# Altium project QDrive.PrjPcb
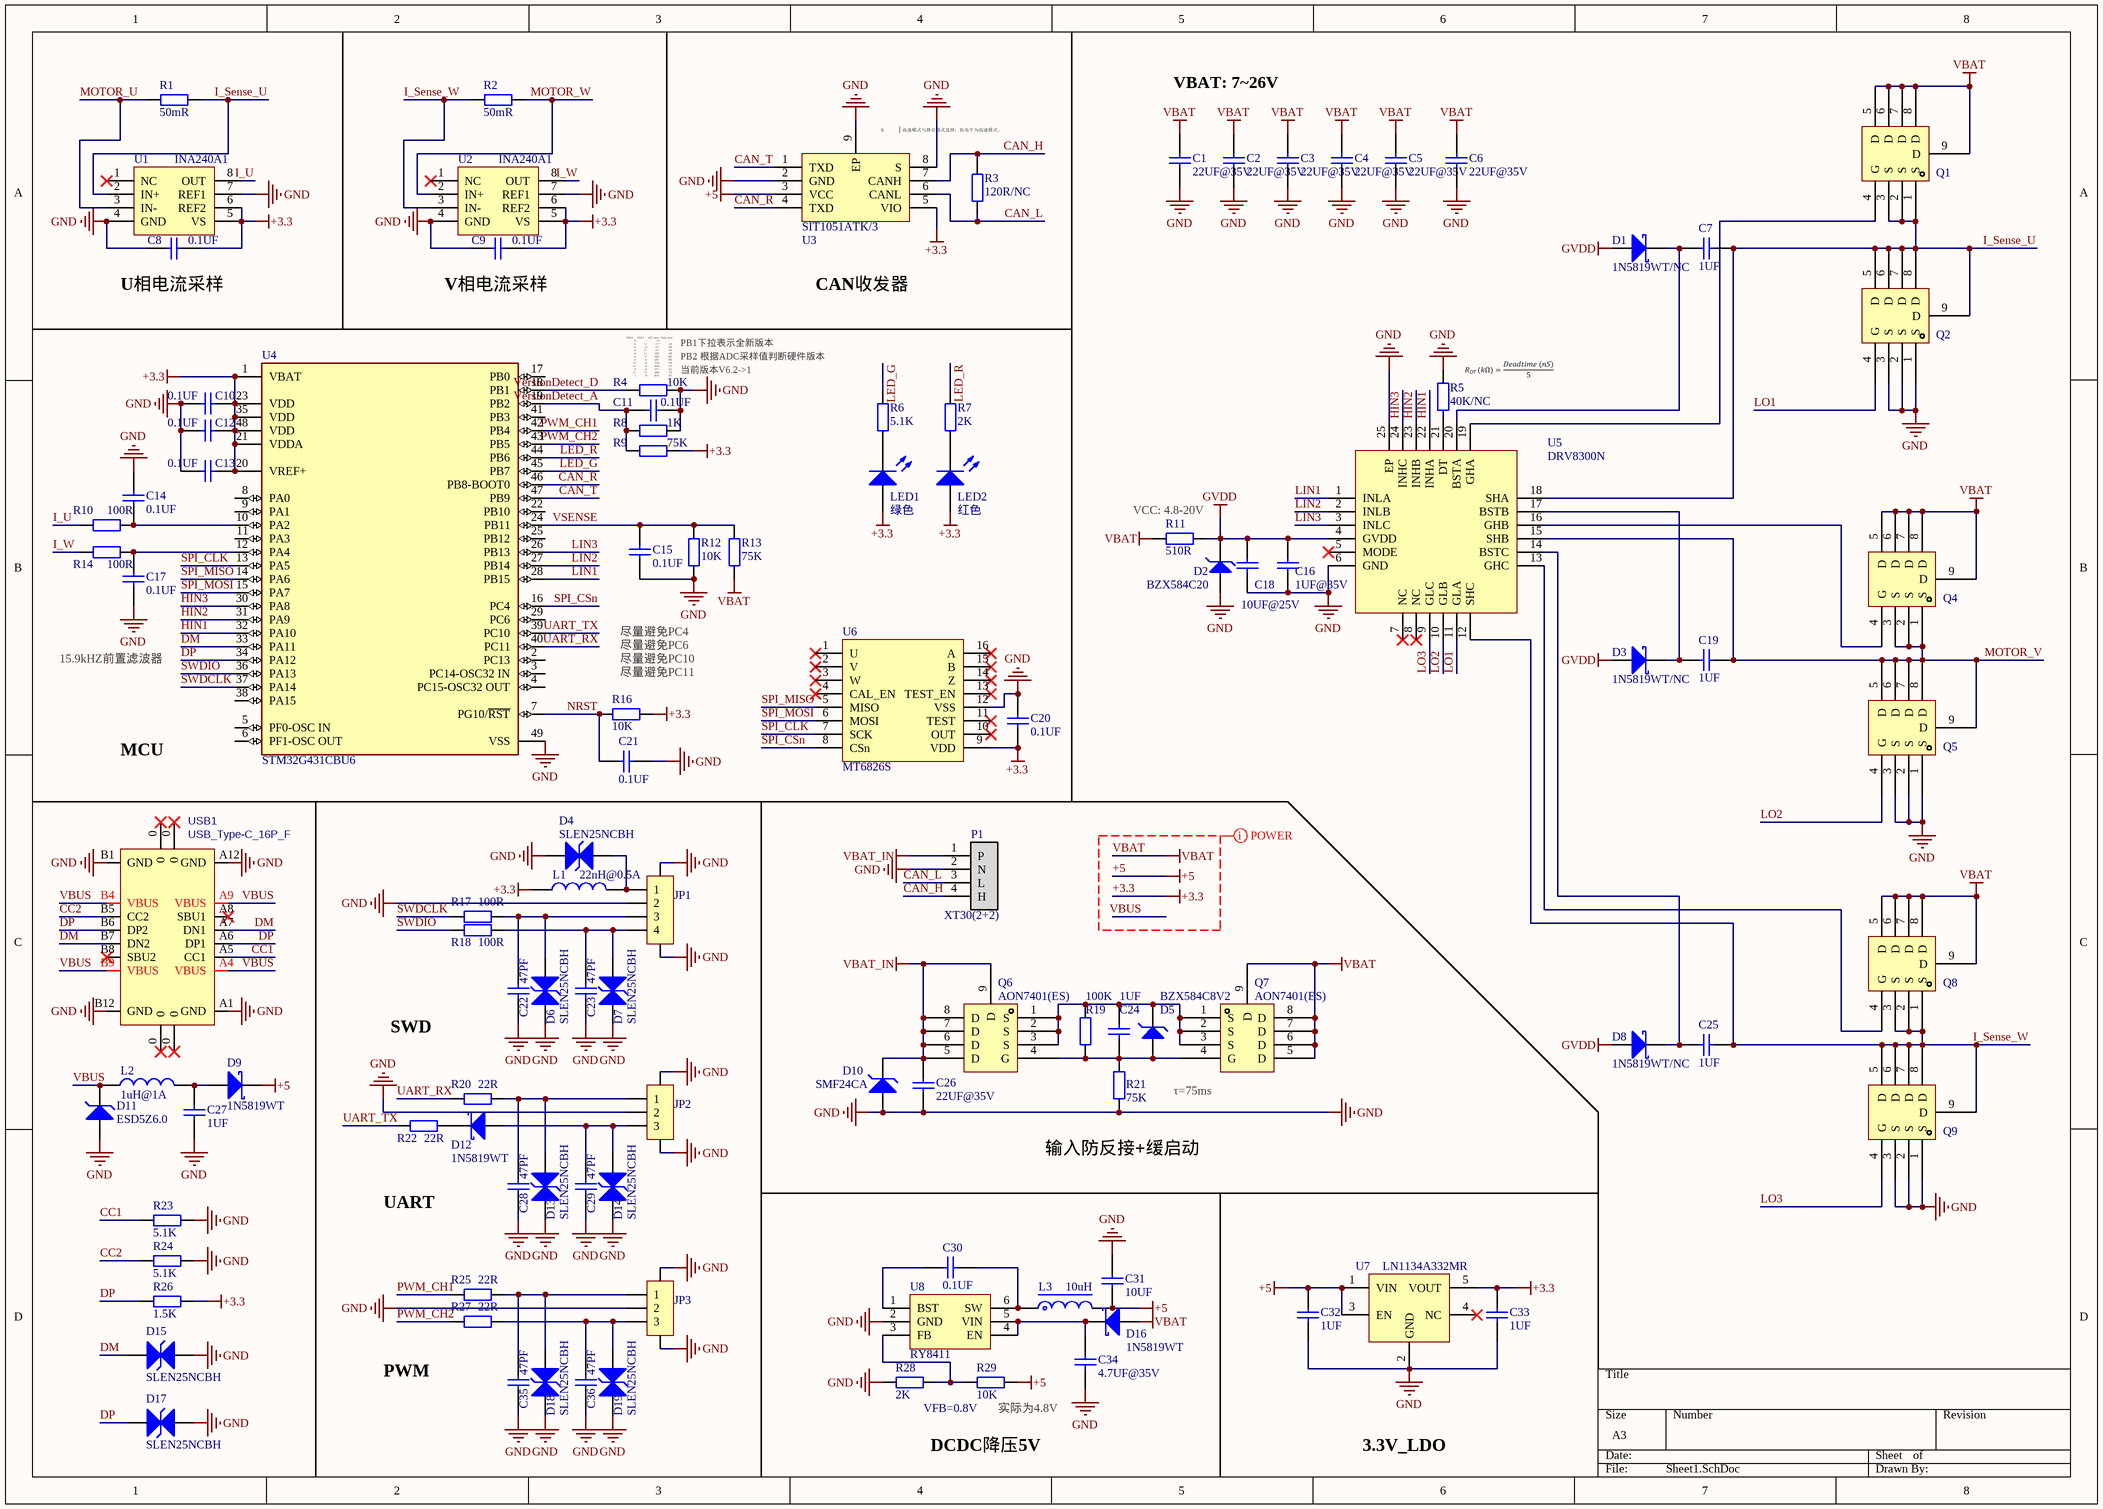
[diagram p0: Sheet1.SchDoc]
1 sheet, 109 parts. Net scope: global (net labels, ports and power ports of the same name join across sheets).
Board file: PCB1.PcbDoc

## Sheet Sheet1.SchDoc
size A3; SheetNumber: 1; SheetTotal: 1

### Parts
C1  22UF@35V  [C1206_NS]
C2  22UF@35V  [C1206_NS]
C3  22UF@35V  [C1206_NS]
C4  22UF@35V  [C1206_NS]
C5  22UF@35V  [C1206_NS]
C6  22UF@35V  [C1206_NS]
C7  1UF  [C0603_NS]
C8  0.1UF  [C0402_NS]
C9  0.1UF  [C0402_NS]
C10  0.1UF  [C0402_NS]
C11  0.1UF  [C0402_NS]
C12  0.1UF  [C0402_NS]
C13  0.1UF  [C0402_NS]
C14  0.1UF  [C0402_NS]
C15  0.1UF  [C0402_NS]
C16  1UF@35V  [C0603_NS]
C17  0.1UF  [C0402_NS]
C18  10UF@25V  [C0603_NS]
C19  1UF  [C0603_NS]
C20  0.1UF  [C0402_NS]
C21  0.1UF  [C0402_NS]
C22  47PF  [C0402_NS]
C23  47PF  [C0402_NS]
C24  1UF  [C0402_NS]
C25  1UF  [C0603_NS]
C26  22UF@35V  [C1206_NS]
C27  1UF  [C0603_NS]
C28  47PF  [C0402_NS]
C29  47PF  [C0402_NS]
C30  0.1UF  [C0402_NS]
C31  10UF  [C0805_NS]
C32  1UF  [C0402_NS]
C33  1UF  [C0402_NS]
C34  4.7UF@35V  [C0805_NS]
C35  47PF  [C0402_NS]
C36  47PF  [C0402_NS]
D1  1N5819WT/NC  [SOD-523]
D2  BZX584C20  [SOD-523]
D3  1N5819WT/NC  [SOD-523]
D4  SLEN25NCBH  [DFN1006-2L_L1.0_W0.6_P0.7]
D5  BZX584C8V2  [SOD-523]
D6  SLEN25NCBH  [DFN1006-2L_L1.0_W0.6_P0.7]
D7  SLEN25NCBH  [DFN1006-2L_L1.0_W0.6_P0.7]
D8  1N5819WT/NC  [SOD-523]
D9  1N5819WT  [SOD-523]
D10  SMF24CA  [SOD-123]
D11  ESD5Z6.0  [SOD-523]
D12  1N5819WT  [SOD-523]
D13  SLEN25NCBH  [DFN1006-2L_L1.0_W0.6_P0.7]
D14  SLEN25NCBH  [DFN1006-2L_L1.0_W0.6_P0.7]
D15  SLEN25NCBH  [DFN1006-2L_L1.0_W0.6_P0.7]
D16  1N5819WT  [SOD-523]
D17  SLEN25NCBH  [DFN1006-2L_L1.0_W0.6_P0.7]
D18  SLEN25NCBH  [DFN1006-2L_L1.0_W0.6_P0.7]
D19  SLEN25NCBH  [DFN1006-2L_L1.0_W0.6_P0.7]
JP1  CON-4P  [HC0.8-WT-4P]  (value not drawn)
JP2  CON-3P  [SH1.0-WT-3P]  (value not drawn)
JP3  CON-3P  [SH1.0-WT-3P]  (value not drawn)
L1  22nH@0.5A  [L0402_NS]
L2  1uH@1A  [L1206_NS]
L3  10uH  [NR3015]
LED1  绿色  [LED0402_NS]
LED2  红色  [LED0402_NS]
P1  XT30(2+2)  [XT30(2+2)PW-M]
Q1  AON7410  [DFN8_L3.3_W3.3_P0.65]  (value not drawn)
Q2  AON7410  [DFN8_L3.3_W3.3_P0.65]  (value not drawn)
Q4  AON7410  [DFN8_L3.3_W3.3_P0.65]  (value not drawn)
Q5  AON7410  [DFN8_L3.3_W3.3_P0.65]  (value not drawn)
Q6  AON7401(ES)  [DFN8_L3.3_W3.3_P0.65]
Q7  AON7401(ES)  [DFN8_L3.3_W3.3_P0.65]
Q8  AON7410  [DFN8_L3.3_W3.3_P0.65]  (value not drawn)
Q9  AON7410  [DFN8_L3.3_W3.3_P0.65]  (value not drawn)
R1  50mR  [R1206_NS]
R2  50mR  [R1206_NS]
R3  120R/NC  [R0603_NS]
R4  10K  [R0402_NS]
R5  40K/NC  [R0402_NS]
R6  5.1K  [R0402_NS]
R7  2K  [R0402_NS]
R8  1K  [R0402_NS]
R9  75K  [R0402_NS]
R10  100R  [R0402_NS]
R11  510R  [R0603_NS]
R12  10K  [R0402_NS]
R13  75K  [R0402_NS]
R14  100R  [R0402_NS]
R16  10K  [R0402_NS]
R17  100R  [R0402_NS]
R18  100R  [R0402_NS]
R19  100K  [R0402_NS]
R20  22R  [R0402_NS]
R21  75K  [R0402_NS]
R22  22R  [R0402_NS]
R23  5.1K  [R0402_NS]
R24  5.1K  [R0402_NS]
R25  22R  [R0402_NS]
R26  1.5K  [R0402_NS]
R27  22R  [R0402_NS]
R28  2K  [R0402_NS]
R29  10K  [R0402_NS]
U1  INA240A1  [TSSOP8_L4.4_W3.0_P0.65]
U2  INA240A1  [TSSOP8_L4.4_W3.0_P0.65]
U3  SIT1051ATK/3  [DFN8_L3.0_W3.0_P0.65]
U4  STM32G431CBU6  [QFN48_L7.0_W7.0_P0.5]
U5  DRV8300N  [QFN24_L4.0_W4.0_P0.5]
U6  MT6826S  [TSSOP16_L5.0_W4.4_P0.65]
U7  LN1134A332MR  [SOT23-5_L3.0_W1.7_P0.95]
U8  RY8411  [SOT23-6_L3.0_W1.7_P0.95]
USB1  USB_Type-C_16P_F  [USB_Type-C_SMD_16P_F]

### Nets
+3.3: C8.2 C9.2 C10.1 C12.1 C13.1 C20.2 C33.2 L1.1 LED1.1(A) LED2.1(A) R9.2 R16.2 R26.2 U1.5(VS) U1.6(REF2) U2.5(VS) U2.6(REF2) U3.5(VIO) U4.1(VBAT) U4.20(VREF+) U4.21(VDDA) U4.23(VDD) U4.35(VDD) U4.48(VDD) U6.9(VDD) U7.5(VOUT)
+5: C31.2 C32.2 D9.2(K) L3.2 R29.1 U3.3(VCC) U7.1(VIN) U7.3(EN)
GND: C1.2 C2.2 C3.2 C4.2 C5.2 C6.2 C8.1 C9.1 C10.2 C11.2 C12.2 C13.2 C14.1 C15.2 C16.2 C17.2 C18.1 C20.1 C21.1 C22.2 C23.2 C26.2 C27.1 C28.2 C29.2 C31.1 C32.1 C33.1 C34.1 C35.2 C36.2 D2.1(A) D4.2(K) D6.2(K) D7.2(K) D10.1(A) D11.1(A) D13.2(K) D14.2(K) D15.2(K) D17.2(K) D18.2(K) D19.2(K) JP1.0 JP1.2 JP2.0 JP2.2 JP3.0 JP3.2 P1.2(N) Q2.1(S) Q2.2(S) Q2.3(S) Q5.1(S) Q5.2(S) Q5.3(S) Q9.1(S) Q9.2(S) Q9.3(S) R4.2 R5.2 R8.2 R12.1 R21.1 R23.1 R24.1 R28.2 U1.4(GND) U1.7(REF1) U2.4(GND) U2.7(REF1) U3.2(GND) U3.8(S) U3.9(EP) U4.49(VSS) U5.6(GND) U5.25(EP) U6.12(VSS) U7.2(GND) U8.2(GND) USB1.A1(GND) USB1.A12(GND) USB1.B1(GND) USB1.B12(GND)
GVDD: C16.1 C18.2 D1.1(A) D2.2(K) D3.1(A) D8.1(A) R11.2 U5.4(GVDD)
VBAT: C1.1 C2.1 C3.1 C4.1 C5.1 C6.1 D16.1(A) Q1.5(D) Q1.6(D) Q1.7(D) Q1.8(D) Q1.9(D) Q4.5(D) Q4.6(D) Q4.7(D) Q4.8(D) Q4.9(D) Q7.5(D) Q7.6(D) Q7.7(D) Q7.8(D) Q7.9(D) Q8.5(D) Q8.6(D) Q8.7(D) Q8.8(D) Q8.9(D) R11.1 R13.2
VBAT_IN: C26.1 D10.2(K) P1.1(P) Q6.5(D) Q6.6(D) Q6.7(D) Q6.8(D) Q6.9(D)
CAN_H: P1.4(H) R3.2 U3.7(CANH)
CAN_L: P1.3(L) R3.1 U3.6(CANL)
CAN_R: U3.4(TXD) U4.46(PB8-BOOT0)
CAN_T: U3.1(TXD) U4.47(PB9)
CC1: R23.2 USB1.A5(CC1)
CC2: R24.2 USB1.B5(CC2)
DM: D15.1(A) U4.33(PA11) USB1.A7(DN1) USB1.B7(DN2)
DP: D17.1(A) R26.1 U4.34(PA12) USB1.A6(DP1) USB1.B6(DP2)
HIN1: U4.32(PA10) U5.22(INHA)
HIN2: U4.31(PA9) U5.23(INHB)
HIN3: U4.30(PA8) U5.24(INHC)
I_Sense_U: C7.1 Q1.1(S) Q1.2(S) Q1.3(S) Q2.5(D) Q2.6(D) Q2.7(D) Q2.8(D) Q2.9(D) R1.1 U1.2(IN+) U5.18(SHA)
I_Sense_W: C25.1 Q8.1(S) Q8.2(S) Q8.3(S) Q9.5(D) Q9.6(D) Q9.7(D) Q9.8(D) Q9.9(D) R2.2 U2.3(IN-) U5.12(SHC)
I_U: R10.2 U1.8(OUT)
I_W: R14.2 U2.8(OUT)
LED_G: R6.1 U4.45(PB7)
LED_R: R7.1 U4.44(PB6)
LIN1: U4.28(PB15) U5.1(INLA)
LIN2: U4.27(PB14) U5.2(INLB)
LIN3: U4.26(PB13) U5.3(INLC)
LO1: Q2.4(G) U5.11(GLA)
LO2: Q5.4(G) U5.10(GLB)
LO3: Q9.4(G) U5.9(GLC)
MOTOR_U: R1.2 U1.3(IN-)
MOTOR_V: C19.1 Q4.1(S) Q4.2(S) Q4.3(S) Q5.5(D) Q5.6(D) Q5.7(D) Q5.8(D) Q5.9(D) U5.15(SHB)
MOTOR_W: R2.1 U2.2(IN+)
NRST: C21.2 R16.1 U4.7(PG10/~{RST})
PWM_CH1: R25.1 U4.42(PB4)
PWM_CH2: R27.1 U4.43(PB5)
SPI_CLK: U4.13(PA5) U6.7(SCK)
SPI_CSn: U4.16(PC4) U6.8(CSn)
SPI_MISO: U4.14(PA6) U6.5(MISO)
SPI_MOSI: U4.15(PA7) U6.6(MOSI)
SWDCLK: R17.1 U4.37(PA14)
SWDIO: R18.1 U4.36(PA13)
UART_RX: R20.1 U4.40(PC11)
UART_TX: R22.1 U4.39(PC10)
VBUS: D11.2(K) L2.1 USB1.A4(VBUS) USB1.A9(VBUS) USB1.B4(VBUS) USB1.B9(VBUS)
VersionDetect_A: C11.1 R8.1 R9.1 U4.19(PB2)
VersionDetect_D: R4.1 U4.18(PB1)
VSENSE: C15.1 R12.2 R13.1 U4.24(PB11)
NetC7_2: C7.2 D1.2(K) U5.20(BSTA)
NetC14_2: C14.2 R10.1 U4.10(PA2)
NetC17_1: C17.1 R14.1 U4.12(PA4)
NetC19_2: C19.2 D3.2(K) U5.17(BSTB)
NetC22_1: C22.1 D6.1(A) JP1.3 R17.2
NetC23_1: C23.1 D7.1(A) JP1.4 R18.2
NetC24_1: C24.1 D5.2(K) Q6.1(S) Q6.2(S) Q6.3(S) Q7.1(S) Q7.2(S) Q7.3(S) R19.2
NetC24_2: C24.2 D5.1(A) Q6.4(G) Q7.4(G) R19.1 R21.2
NetC25_2: C25.2 D8.2(K) U5.14(BSTC)
NetC27_2: C27.2 D9.1(A) L2.2
NetC28_1: C28.1 D13.1(A) JP2.1 R20.2
NetC29_1: C29.1 D12.1(A) D14.1(A) JP2.3
NetC30_1: C30.1 U8.1(BST)
NetC30_2: C30.2 L3.1 U8.6(SW)
NetC34_2: C34.2 D16.2(K) U8.4(EN) U8.5(VIN)
NetC35_1: C35.1 D18.1(A) JP3.1 R25.2
NetC36_1: C36.1 D19.1(A) JP3.3 R27.2
NetD4_1: D4.1(A) JP1.1 L1.2
NetD12_2: D12.2(K) R22.2
NetLED1_2: LED1.2(K) R6.2
NetLED2_2: LED2.2(K) R7.2
NetQ1_4: Q1.4(G) U5.19(GHA)
NetQ4_4: Q4.4(G) U5.16(GHB)
NetQ8_4: Q8.4(G) U5.13(GHC)
NetR5_1: R5.1 U5.21(DT)
NetR28_1: R28.1 R29.2 U8.3(FB)

Not connected (* = marked no-connect by the designer): U1 1(NC)*; U2 1(NC)*; U4 2(PC13) 3(PC14-OSC32_IN) 4(PC15-OSC32_OUT) 5(PF0-OSC_IN) 6(PF1-OSC_OUT) 8(PA0) 9(PA1) 11(PA3) 17(PB0) 22(PB10) 25(PB12) 29(PC6) 38(PA15) 41(PB3); U5 5(MODE)* 7(NC)* 8(NC)*; U6 1(U)* 2(V)* 3(W)* 4(CAL_EN)* 10(OUT)* 11(TEST)* 13(TEST_EN)* 14(Z)* 15(B)* 16(A)*; U7 4(NC)*; USB1 0* A8(SBU1)* B8(SBU2)*

### Layout directives
net class POWER: +3.3, +5, VBAT, VBUS

### Notes on the sheet
- VBAT: 7~26V
- (near C8) U相电流采样
- (near C9) V相电流采样
- CAN收发器
- PB1下拉表示全新版本
- (near R4) PB2 根据ADC采样值判断硬件版本
- (near R4) 当前版本V6.2->1
- (near R11) VCC: 4.8-20V
- 尽量避免PC4
- 尽量避免PC6
- 15.9kHZ前置滤波器
- (near R16) 尽量避免PC10
- (near R16) 尽量避免PC11
- MCU
- SWD
- (near Q7) τ=75ms
- (near R21) 输入防反接+缓启动
- UART
- PWM
- VFB=0.8V
- DCDC降压5V
- (near R29) 实际为4.8V
- 3.3V_LDO

### Library data of the parts
C1-C36 = C: 贴片电容/MLCC电容; BOM名称: MLCC
D1 D3 D8 D9 D12 D16 = SSXX: 肖特基二极管; 属性: 个位*10V/十位A; BOM名称: 肖特基二极管
D2 D5 = MM1ZXX: 稳压二极管; Power Dissipation (Pd): 500mW; Voltage: 5.1V; BOM名称: 稳压二极管
D4 D6 D7 D13-D15 D17-D19 = PESD5V0F1BL: 双向静电和浪涌保护(TVS/ESD); BOM名称: PESD5V0F1BL
D10 D11 = TVS: TVS通用; BOM名称: TVS
JP1 = Header 4: 4P连接器; BOM名称: 4P连接器
JP2 JP3 = Header 3: 3P连接器; BOM名称: 3P连接器
L1 L2 = L: 小功率贴片电感; BOM名称: 小功率贴片电感
L3 = L-NR: 太诱-NR磁胶电感; BOM名称: NR磁胶电感
LED1 LED2 = LED: 贴片LED; BOM名称: 贴片LED
P1 = XT30(2+2): XT30(2+2)连接器
Q1 Q2 Q4 Q5 Q8 Q9 = WSD3066DN33: 类型:N沟道;漏源电压(Vdss):30V;连续漏极电流(Id):50A;导通电阻(RDS(on)Vgs,Id):5.7mΩ@10V,35A;阈值电压(Vgs(th)@Id):2.5V@250uA;; Type: N沟道; Drain Source Voltage (Vdss): 30V; Continuous Drain Current (Id): 50A; Power Dissipation (Pd): 45W; Device: WSD3066DN33; LCSC Part Name: N沟道 30V 50A; Supplier Footprint: DFN 3.3x3.3-8; Drain Source On Resistance (RDS(on)@Vgs,Id): 5.7mΩ@10V,35A; Gate Threshold Voltage (Vgs(th)@Id): 2.5V@250uA
Q6 Q7 = FH13P04G6: 类型:P沟道;漏源电压(Vdss):30V;连续漏极电流(Id):30A;功率(Pd):30W;导通电阻(RDS(on)@Vgs,Id):13mΩ@10V,8A;; Type: P沟道; Continuous Drain Current (Id): 30A; Power Dissipation (Pd): 20W; Drain Source On Resistance (RDS(on)@Vgs,Id): 9mΩ@10V,15A; Device: FH13P04G6; LCSC Part Name: P沟道 40V 30A; Supplier Footprint: PDFN-8(3.3*3.3)
R1-R14 R16-R29 = R: 贴片电阻; BOM名称: 贴片电阻
U1 U2 = INA240: 具有增强的 PWM 抑制能力的 -4V 至 80V、双向、超精密电流感应放大器
U3 = SIT1051ATK/3: 5V 供电， IO 口兼容 3.3V，± 70V 总线耐压， CAN FD 静音模式总线收发器; Duplex: Half; Data Rate: 5Mbps; Type: Transceiver; Protocol: CAN
U4 = STM32G431CBU6: Microcontroller 32-Bit ARM Cortex-M4 RISC 128KB Flash 1.71V to 3.6V QFN48; Manufacturer: STMicroelectronics; Manufacturer Part Number: STM32G431CBT6; Number Of Adc Channels: 17; Number Of I/Os: 38; Standoff Height: 0.05mm; Number Of Usb Channels: 1; Data Bus Width: 32bits; Number Of I2C Channels: 3; Number Of Pwm Channels: 31; Frequency: 170MHz; Number Of Timers/Counters: 14; Ram Size: 32KBytes; Max Junction Temp: +105°C; Memory Size: 128KBytes; Min Supply Voltage: 1.62V; Number Of Uart Channels: 4; Interface: I2C,SPI,UART,USART,CAN,USB,LIN,IrDA,I2S; Temperature Range Low: -40°C; Lead Free: Yes; Device Class L3: Microcontrollers; Number Of Cores: 1; Temperature Range High: +85°C; Height: 1.6mm; Digikey Description: MAINSTREAM ARM CORTEX-M4+ MCU 17; Device Class L1: Integrated Circuits (ICs); Package: LQFP48; RoHS: TRUE; Number Of A/D Converters: 1; Core Architecture: Arm Cortex-M4; Memory Type: FLASH; Device Class L2: Embedded Processors and Controllers; ComponentLink2Description: Datasheet; Temperature: -40°C to +85°C; Ambient Temperature Range High: +85°C; Ambient Temperature Range Low: -40°C; Octopart: https://octopart.com/stm32g431cbt6-stmicroelectronics-98835224; Max Supply Voltage: 3.6V; ComponentLink2URL: https://www.st.com/resource/en/datasheet/stm32g431cb.pdf; Automotive: No; Number Of Spi Channels: 3; Category: IC
U5 = DRV8300D: 具有自举二极管的最大 100V 简单三相栅极驱动器
U6 = MT6826S: 15位高分辨率、高速磁性角度编码器IC
U7 = RT9013-33GB
U8 = JW5026: 40V/1A/1.1MHz同步降压转换器
USB1 = USB_Type-C_16P_F: USB_Type-C母座; BOM名称: USB_Type-C母座